# EAGLE design PCB-BI8-2x2 (EAGLE 6.4)

## Sheet 1 of 2
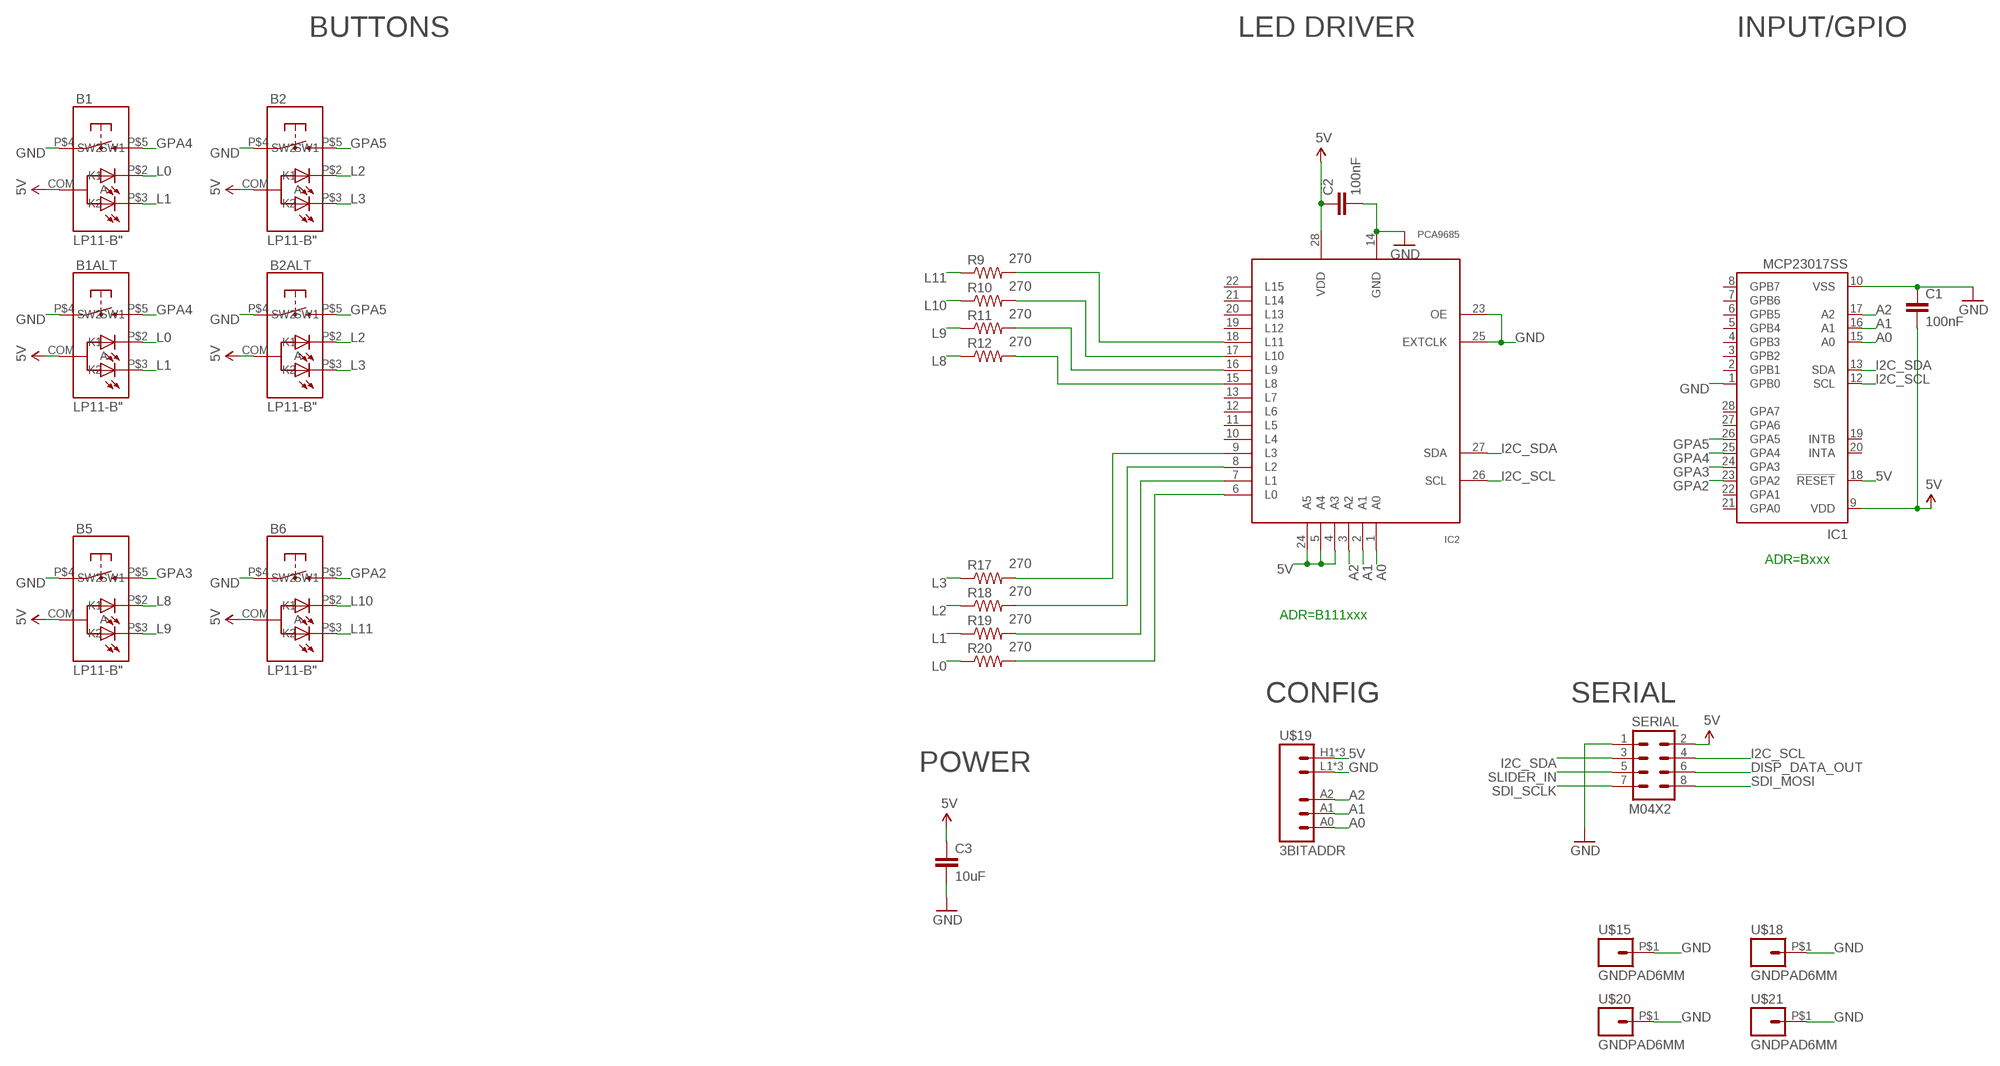
[diagram p0: schematic, sheet 1]

### Parts
B1  LP11-B"  [LP11]
B1ALT  LP11-B"  [LP11]
B2  LP11-B"  [LP11]
B2ALT  LP11-B"  [LP11]
B5  LP11-B"  [LP11]
B6  LP11-B"  [LP11]
C1  100nF  CAP0603-CAP  [0603-CAP]
C2  100nF  CAP0603-CAP  [0603-CAP]
C3  10uF  CAP0805  [0805]
IC1  MCP23017SS  [SSOP28]
IC2  PCA9685  [TSSOP28]
R9  270  RESISTOR0603-RES  [0603-RES]
R10  270  RESISTOR0603-RES  [0603-RES]
R11  270  RESISTOR0603-RES  [0603-RES]
R12  270  RESISTOR0603-RES  [0603-RES]
R17  270  RESISTOR0603-RES  [0603-RES]
R18  270  RESISTOR0603-RES  [0603-RES]
R19  270  RESISTOR0603-RES  [0603-RES]
R20  270  RESISTOR0603-RES  [0603-RES]
SERIAL  M04X2  [2X4]
U$15  GNDPAD6MM  [3.2MMPAD6MM]
U$18  GNDPAD6MM  [3.2MMPAD6MM]
U$19  3BITADDR  [3BITADDR]
U$20  GNDPAD6MM  [3.2MMPAD6MM]
U$21  GNDPAD6MM  [3.2MMPAD6MM]

### Nets
5V [Power]: B1.COM(A) B1ALT.COM(A) B2.COM(A) B2ALT.COM(A) B5.COM(A) B6.COM(A) C1.2 C2.1 C3.1 IC1.9(VDD) IC1.18(!RESET) IC2.4(A3) IC2.5(A4) IC2.24(A5) IC2.28(VDD) SERIAL.2 U$19.H1(VCC) U$19.H2(VCC) U$19.H3(VCC)
A0: IC1.15(A0) IC2.1(A0) U$19.A0
A1: IC1.16(A1) IC2.2(A1) U$19.A1
A2: IC1.17(A2) IC2.3(A2) U$19.A2
DISP_DATA_OUT: SERIAL.6
GND [Power]: B1.P$4(SW1) B1ALT.P$4(SW1) B2.P$4(SW1) B2ALT.P$4(SW1) B5.P$4(SW1) B6.P$4(SW1) C1.1 C2.2 C3.2 IC1.1(GPB0) IC1.10(VSS) IC2.14(GND) IC2.23(OE) IC2.25(EXTCLK) SERIAL.1 U$15.P$1 U$18.P$1 U$19.L1(GND) U$19.L2(GND) U$19.L3(GND) U$20.P$1 U$21.P$1
GPA2: B6.P$5(SW2) IC1.23(GPA2)
GPA3: B5.P$5(SW2) IC1.24(GPA3)
GPA4: B1.P$5(SW2) B1ALT.P$5(SW2) IC1.25(GPA4)
GPA5: B2.P$5(SW2) B2ALT.P$5(SW2) IC1.26(GPA5)
I2C_SCL: IC1.12(SCL) IC2.26(SCL) SERIAL.4
I2C_SDA: IC1.13(SDA) IC2.27(SDA) SERIAL.3
L0: B1.P$2(K1) B1ALT.P$2(K1) R20.1
L1: B1.P$3(K2) B1ALT.P$3(K2) R19.1
L2: B2.P$2(K1) B2ALT.P$2(K1) R18.1
L3: B2.P$3(K2) B2ALT.P$3(K2) R17.1
L8: B5.P$2(K1) R12.1
L9: B5.P$3(K2) R11.1
L10: B6.P$2(K1) R10.1
L11: B6.P$3(K2) R9.1
N$10: IC2.9(L3) R17.2
N$11: IC2.8(L2) R18.2
N$12: IC2.7(L1) R19.2
N$19: IC2.6(L0) R20.2
N$20: IC2.15(L8) R12.2
N$21: IC2.16(L9) R11.2
N$22: IC2.17(L10) R10.2
N$23: IC2.18(L11) R9.2
SDI_MOSI: SERIAL.8
SDI_SCLK: SERIAL.7
SLIDER_IN: SERIAL.5
Unconnected: IC1.2(GPB1) IC1.3(GPB2) IC1.4(GPB3) IC1.5(GPB4) IC1.6(GPB5) IC1.7(GPB6) IC1.8(GPB7) IC1.19(INTB) IC1.20(INTA) IC1.21(GPA0) IC1.22(GPA1) IC1.27(GPA6) IC1.28(GPA7) IC2.10(L4) IC2.11(L5) IC2.12(L6) IC2.13(L7) IC2.19(L12) IC2.20(L13) IC2.21(L14) IC2.22(L15)

### Notes on the sheet
- BUTTONS | LED DRIVER | INPUT/GPIO
- ADR=Bxxx
- ADR=B111xxx
- CONFIG | SERIAL
- POWER

## Sheet 2 of 2

## Library data of the parts
B1 B1ALT B2 B2ALT B5 B6 = SKAARHOJ:LP11-B
C1-C3 = SparkFun:CAP: Capacitor Standard 0603 ceramic capacitor, and 0.1" leaded capacitor.
IC1 = microchip:MCP23017: http://ww1.microchip.com/downloads/en/DeviceDoc/21952a.pdf Source: http://ww1.microchip.com/downloads/en/DeviceDoc/21952a.pdf; MF: MICROCHIP; MPN: MCP23017-E/SS; OC_FARNELL: 1467674; OC_NEWARK: 31K2960
IC2 = wsmith:PCA9685
R9-R12 R17-R20 = SparkFun:RESISTOR: Resistor Basic schematic elements and footprints for 0603, 1206, and PTH resistors.
SERIAL = SparkFun:M04X2
U$15 U$18 U$20 U$21 = SKAARHOJ:GNDPAD
U$19 = SKAARHOJ:3BITADDR

## Net classes
0 default: width 0.203 mm, drill 0.406 mm, clearance 0.203 mm
1 Power: width 0.406 mm, drill 0.61 mm, clearance 0.203 mm

## Board
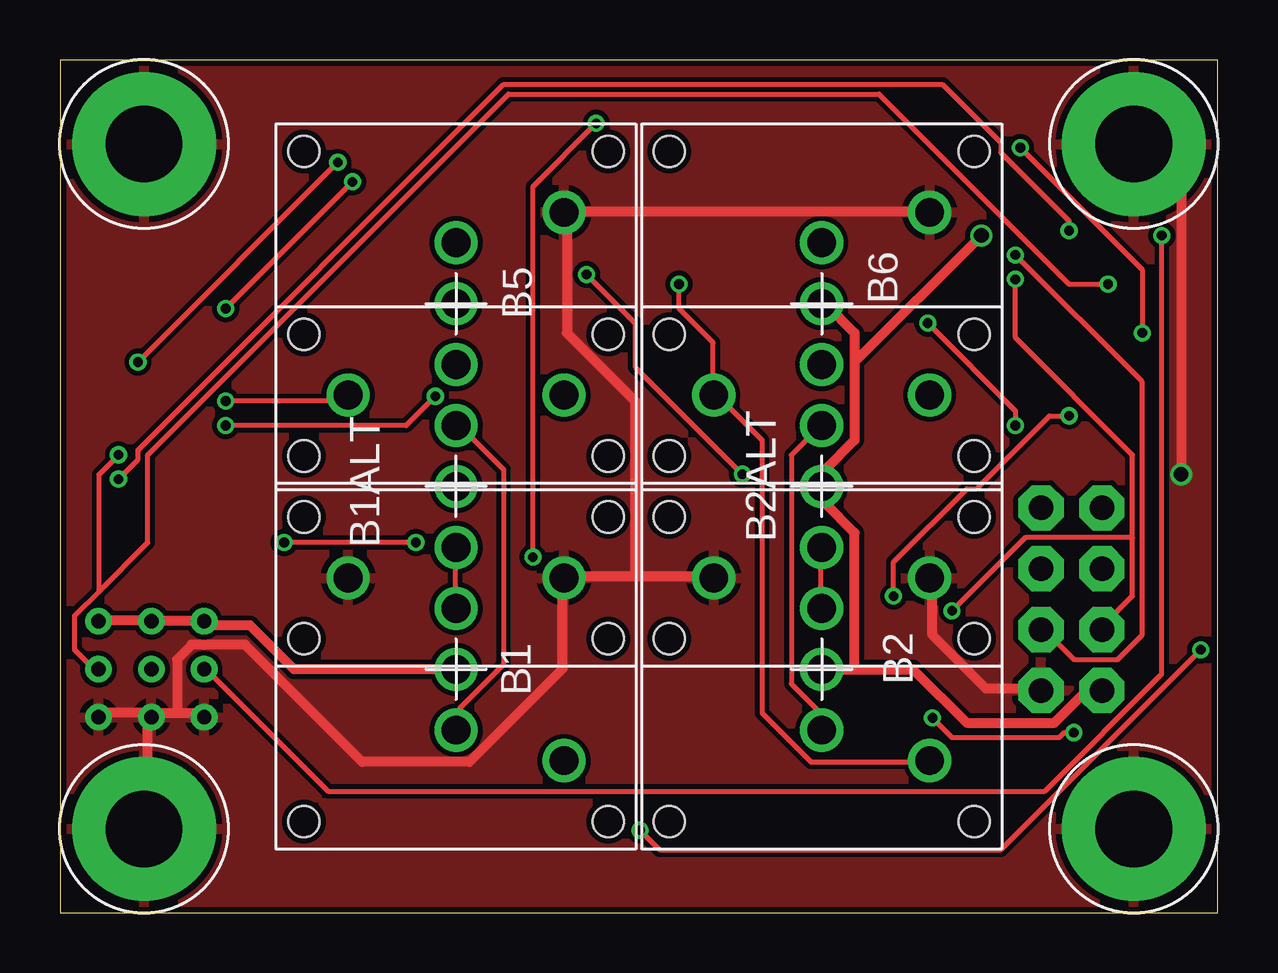
[diagram p1: board, top side]
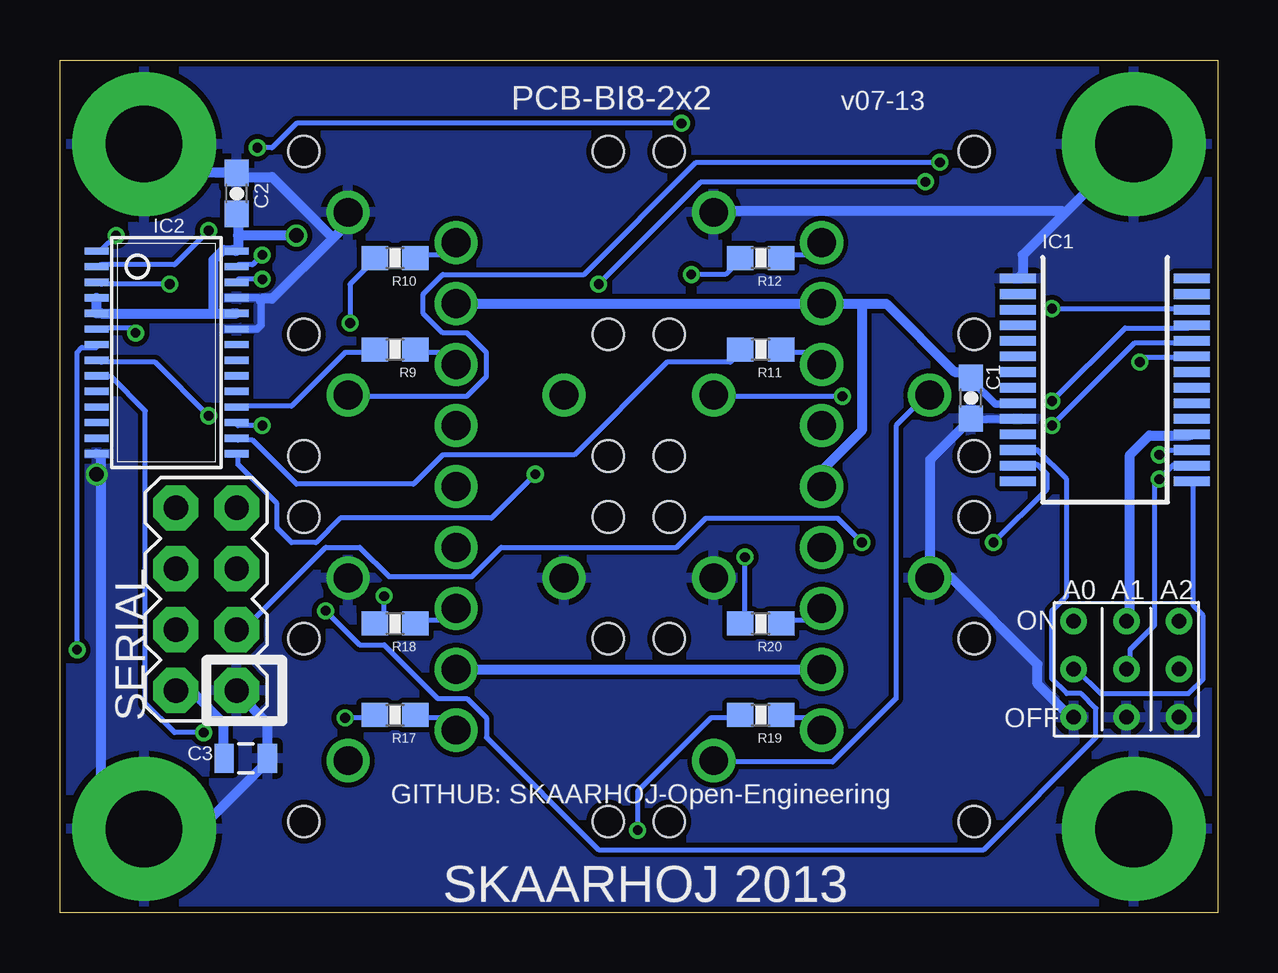
[diagram p2: board, bottom side, seen from below]

Size 48.26 x 35.56 mm. Coordinates in mm from the lower left corner, seen from the top.
Outline: 0,0 48.26,0 48.26,35.56 0,35.56 0,0
Copper layers (1*16): Top 0.035mm / dielectric 1.5mm / Bottom 0.035mm
Design rules "Fusion_eagle_rule_v1.1": minimum track width 6mil, minimum drill 12mil, track to track 6mil, track to pad 6mil, pad to pad 6mil, via to via 6mil, smd to smd 0mil, copper to edge 10mil, drill to drill 10mil, minimum pad ring 10mil, minimum via ring 6mil, stop-mask expansion 2mil, vias tented up to drill 100mil, thermal gap 10mil

### Footprints (pad centres in the part's own frame; a part is rotated, then mirrored left to right if it is on the bottom)
LP11 = drill 1.2: COM 0,0; P$2 0,2.54; P$3 0,-2.54; P$4 4.5,3.81; P$5 4.5,-3.81 | hole 1.3: -6.35,6.35; 6.35,6.35; 6.35,-6.35; -6.35,-6.35
0603-CAP = smd 1.1 x 1: 1 -0.85,0; 2 0.85,0
0805 = smd 0.8 x 1.2: 1 -0.9,0; 2 0.9,0
SSOP28 = smd 0.4 x 1.5: 1 -4.225,-3.625; 2 -3.575,-3.625; 3 -2.925,-3.625; 4 -2.275,-3.625; 5 -1.625,-3.625; 6 -0.975,-3.625; 7 -0.325,-3.625; 8 0.325,-3.625; 9 0.975,-3.625; 10 1.625,-3.625; 11 2.275,-3.625; 12 2.925,-3.625; 13 3.575,-3.625; 14 4.225,-3.625; 15 4.225,3.625; 16 3.575,3.625; 17 2.925,3.625; 18 2.275,3.625; 19 1.625,3.625; 20 0.975,3.625; 21 0.325,3.625; 22 -0.325,3.625; 23 -0.975,3.625; 24 -1.625,3.625; 25 -2.275,3.625; 26 -2.925,3.625; 27 -3.575,3.625; 28 -4.225,3.625
TSSOP28 = smd 0.305 x 0.991: 1 -4.225,-2.918; 2 -3.575,-2.918; 3 -2.925,-2.918; 4 -2.275,-2.918; 5 -1.625,-2.918; 6 -0.975,-2.918; 7 -0.325,-2.918; 8 0.325,-2.918; 9 0.975,-2.918; 10 1.625,-2.918; 11 2.275,-2.918; 12 2.925,-2.918; 13 3.575,-2.918; 14 4.225,-2.918; 15 4.225,2.918; 16 3.575,2.918; 17 2.925,2.918; 18 2.275,2.918; 19 1.625,2.918; 20 0.975,2.918; 21 0.325,2.918; 22 -0.325,2.918; 23 -0.975,2.918; 24 -1.625,2.918; 25 -2.275,2.918; 26 -2.925,2.918; 27 -3.575,2.918; 28 -4.225,2.918
0603-RES = smd 1.1 x 1: 1 -0.85,0; 2 0.85,0
2X4 = drill 1.016 pad 1.88 octagon: 1 -3.81,-1.27; 2 -3.81,1.27; 3 -1.27,-1.27; 4 -1.27,1.27; 5 1.27,-1.27; 6 1.27,1.27; 7 3.81,-1.27; 8 3.81,1.27
3.2MMPAD6MM = drill 3.2 pad 6: P$1 0,0
3BITADDR = drill 0.6: A0 -2.2,0; A1 0,0; A2 2.2,0; H1 -2.2,2; H2 0,2; H3 2.2,2; L1 -2.2,-2; L2 0,-2; L3 2.2,-2

### Placement (x,y rotation side)
B1  16.51,10.16 0 top
B1ALT  16.51,17.78 180 top
B2  31.75,10.16 0 top
B2ALT  31.75,17.78 180 top
B5  16.51,25.4 0 top
B6  31.75,25.4 0 top
C1  10.29,21.46 90 bottom
C2  40.89,30 90 bottom
C3  40.51,6.45 0 bottom
IC1  4.7,22.23 270 bottom
IC2  43.81,23.37 270 bottom
R9  34.29,23.5 180 bottom
R10  34.29,27.3 180 bottom
R11  19.05,23.5 180 bottom
R12  19.05,27.3 180 bottom
R17  34.29,8.26 180 bottom
R18  34.29,12.06 180 bottom
R19  19.05,8.26 180 bottom
R20  19.05,12.06 180 bottom
SERIAL  42.16,13.08 90 bottom
U$15  3.5,3.5 0 top
U$18  44.76,3.5 0 top
U$19  3.81,10.16 0 bottom
U$20  3.5,32.06 0 top
U$21  44.76,32.06 0 top

### Tracks (layer width: path | path; a pad name or v marks a point on that pad's centre or on a via)
5V  (via drill 0.61)
  Top 0.406: 33.12,22.96 33.12,24.18 31.9,25.4 B6.COM | 33.12,22.96 33.12,19.71 31.9,18.49 31.9,17.88 B2ALT.COM 31.9,17.68 31.9,17.07 33.12,15.85 33.12,10.16 | 33.12,22.96 v38.41,28.25 | U$19.H3 1.63,12.19 3.66,12.19 U$19.H2 3.86,12.19 5.89,12.19 U$19.H1 6.1,11.99 7.92,11.99 9.75,10.16 B1.COM | B2.COM 33.12,10.16 | 33.12,10.16 35.56,10.16 37.8,7.92 41.45,7.92 42.67,9.14 43.28,9.14 SERIAL.2
  Bottom 0.305: IC1.9 8.37,21.21 9.27,21.21 10.29,22.23 C1.2
  Bottom 0.406: 14.83,25.4 B5.COM B6.COM | 14.83,25.4 13.82,25.4 10.97,22.55 10.16,22.55 C1.2 | 14.83,25.4 14.83,20.12 16.46,18.49 16.46,17.88 B1ALT.COM | 40.84,28.25 40.84,29.06 C2.1 | 40.84,28.25 40.84,27.64 IC2.28 41.05,27.64 41.45,27.64 41.86,27.23 41.86,24.99 | 41.86,24.99 46.53,24.99 IC2.5 46.74,25.6 IC2.4 | 41.86,24.99 41.05,24.99 IC2.24 | v38.41,28.25 40.84,28.25 | IC1.18 1.22,19.91 2.85,19.91 3.66,19.1 3.66,12.19 U$19.H2 | C3.1 41.45,6.5 41.45,7.92 42.67,9.14 43.28,9.14 SERIAL.2 | B2.COM B1.COM
A0  (via drill 0.41)
  Top 0.203: v45.92,28.25 45.92,9.96 41.05,5.08 11.18,5.08 6.1,10.16 U$19.A0
  Bottom 0.203: v45.92,28.25 46.53,27.64 IC2.1 | IC1.15 1.02,17.88 1.02,12.8 0.61,12.39 0.61,9.75 1.22,9.14 4.88,9.14 5.89,10.16 U$19.A0
A1  (via drill 0.41)
  Top 0.203: v42.06,28.45 42.06,28.85 39.22,31.7 39.22,32.11 36.78,34.54 18.49,34.54 3.25,19.3 3.25,18.9 v2.44,18.09
  Bottom 0.203: v42.06,28.45 43.48,27.03 46.53,27.03 IC2.2 | IC1.16 1.22,18.69 1.83,18.69 v2.44,18.09 2.64,17.88 2.64,11.99 3.66,10.97 3.66,10.16 U$19.A1
A2  (via drill 0.41)
  Top 0.203: v43.69,26.21 42.06,26.21 34.14,34.14 18.69,34.14 3.66,19.1 3.66,15.44 1.63,13.41 | 1.63,13.41 0.61,12.39 0.61,10.97 1.42,10.16 U$19.A2 | v2.44,19.1 1.63,18.29 1.63,13.41
  Bottom 0.203: v43.69,26.21 46.53,26.21 IC2.3 | v2.44,19.1 2.23,19.3 1.22,19.3 IC1.17
GND  (via drill 0.61)
  Top 0.406: U$19.L3 1.63,8.33 3.66,8.33 U$19.L2 | 4.88,8.33 3.86,8.33 U$19.L2 | 4.88,8.33 5.89,8.33 U$19.L1 | U$19.L2 3.66,8.13 3.66,3.66 U$15.P$1 | B2.P$4 36.37,13.82 36.37,11.58 38.61,9.35 40.84,9.35 SERIAL.1 | 23.98,14.02 27.23,14.02 B2ALT.P$4 | 23.98,14.02 21.13,14.02 B1.P$4 20.93,13.82 20.93,10.16 17.07,6.3 12.6,6.3 7.72,11.18 5.49,11.18 4.88,10.57 4.88,8.33 | 23.98,14.02 23.98,21.34 21.13,24.18 21.13,29.06 B5.P$4 21.13,29.26 36.17,29.26 B6.P$4 | v46.74,18.29 46.74,30.07 44.91,31.9 U$21.P$1
  Bottom 0.305: IC2.25 40.89,25.65 40.01,25.65 39.88,25.53 39.88,24.51 40.05,24.34 IC2.23 | 10.16,20.73 10.01,20.57 9.65,20.57 9.63,20.6 IC1.10
  Bottom 0.406: C1.1 10.16,20.73 11.99,18.9 11.99,14.02 B1ALT.P$4 11.79,14.02 11.18,14.02 7.52,10.36 7.52,9.55 6.1,8.13 U$19.L1 | SERIAL.1 40.84,9.14 39.62,7.92 39.62,6.5 C3.2 39.62,6.3 42.27,3.66 44.7,3.66 U$18.P$1 44.91,3.66 46.53,5.28 46.53,18.29 | 46.53,18.29 46.53,19.1 IC2.14 | 36.88,28.14 36.37,28.65 36.37,29.06 B6.P$4 | 36.88,28.14 39.42,25.6 39.83,25.6 39.88,25.53 | U$21.P$1 44.7,31.9 43.69,30.89 41.05,30.89 C2.2 40.84,30.68 39.42,30.68 36.88,28.14 | U$20.P$1 6.4,29.16 | 6.4,29.16 8.13,27.43 8.13,26.62 IC1.1 | B5.P$4 20.93,29.26 6.5,29.26 6.4,29.16 | v46.74,18.29 46.53,18.29
  pour Top: 0,0 48.26,0 48.26,35.56 0,35.56
  pour Bottom: 0,0 48.26,0 48.26,35.56 0,35.56
GPA2  (via drill 0.41)
  Top 0.203: v11.58,31.29 v3.25,22.96
  Bottom 0.203: v3.25,22.96 3.05,23.16 1.22,23.16 IC1.23 | v11.58,31.29 21.74,31.29 26.42,26.62 32.31,26.62 33.12,25.81 33.12,24.99 32.31,24.18 31.29,24.18 30.48,23.37 30.48,22.35 31.29,21.54 36.17,21.54 B6.P$5
GPA3  (via drill 0.41)
  Top 0.203: v6.91,20.32 14.43,20.32 v15.65,21.54
  Bottom 0.203: v6.91,20.32 3.45,23.77 1.22,23.77 IC1.24 | v15.65,21.54 20.93,21.54 B5.P$5
GPA4  (via drill 0.41)
  Top 0.203: v6.91,21.34 11.79,21.34 11.99,21.54 B1ALT.P$5
  Bottom 0.203: v6.91,21.34 3.86,24.38 1.22,24.38 IC1.25 | B1.P$5 20.93,6.3 16.05,6.3 13.41,8.94 13.41,20.32 12.19,21.54 B1ALT.P$5
GPA5  (via drill 0.41)
  Top 0.203: v12.19,30.48 v6.91,25.2 | v25.81,26.21 25.81,25.2 27.23,23.77 27.23,21.74 B2ALT.P$5 27.43,21.54 29.26,19.71 29.26,8.33 31.29,6.3 36.17,6.3 B2.P$5
  Bottom 0.203: v6.91,25.2 1.22,25.2 IC1.26 | v12.19,30.48 21.54,30.48 v25.81,26.21
I2C_SCL  (via drill 0.41)
  Top 0.203: v39.83,26.42 39.83,23.98 44.7,19.1 44.7,15.65 | 44.7,15.65 44.7,13.21 43.48,11.99 SERIAL.4 | v37.19,12.6 40.23,15.65 44.7,15.65
  Bottom 0.203: v39.83,26.42 40.84,26.42 IC2.26 | v37.19,12.6 35.76,11.18 34.75,11.18 32.51,8.94 31.29,8.94 30.48,8.13 30.48,7.32 25.81,2.64 9.75,2.64 5.08,7.32 5.08,8.53 5.69,9.14 6.3,9.14 6.91,9.75 6.91,12.6 6.3,13.21 6.3,18.09 7.52,19.3 8.13,19.3 IC1.12
I2C_SDA  (via drill 0.41)
  Top 0.203: v39.83,27.43 45.11,22.15 45.11,11.58 44.09,10.57 42.27,10.57 41.05,11.79 SERIAL.3 | v14.83,15.44 v9.35,15.44
  Bottom 0.203: v39.83,27.43 40.23,27.03 40.84,27.03 IC2.27 | v9.35,15.44 7.11,17.68 7.11,18.29 7.52,18.69 8.13,18.69 IC1.13 | v14.83,15.44 15.85,16.46 21.34,16.46 22.55,15.24 29.87,15.24 31.09,14.02 34.54,14.02 35.76,15.24 37.19,15.24 40.44,11.99 40.84,11.99 SERIAL.3
L0
  Top 0.203: B1.P$2 16.46,12.8 16.46,15.24 B1ALT.P$2
  Bottom 0.203: R20.1 18.09,12.19 17.07,12.19 16.66,12.6 B1.P$2
L1
  Top 0.203: B1.P$3 16.66,7.72 16.66,8.53 18.49,10.36 18.49,18.49 16.66,20.32 B1ALT.P$3
  Bottom 0.203: R19.1 18.09,8.13 17.07,8.13 16.66,7.72 B1.P$3
L2
  Top 0.203: B2.P$2 31.7,12.8 31.7,15.24 B2ALT.P$2
  Bottom 0.203: R18.1 33.33,12.19 32.31,12.19 31.9,12.6 B2.P$2
L3
  Top 0.203: B2.P$3 31.7,7.72 31.7,8.33 30.48,9.55 30.48,19.1 31.7,20.32 B2ALT.P$3
  Bottom 0.203: R17.1 33.33,8.13 32.31,8.13 31.9,7.72 B2.P$3
L8
  Bottom 0.203: R12.1 18.09,27.43 17.07,27.43 16.66,27.84 B5.P$2
L9
  Bottom 0.203: R11.1 18.09,23.37 17.07,23.37 16.66,22.96 B5.P$3
L10
  Bottom 0.203: R10.1 33.33,27.43 32.31,27.43 31.9,27.84 B6.P$2
L11
  Bottom 0.203: R9.1 33.33,23.37 32.31,23.37 31.9,22.96 B6.P$3
N$10  (via drill 0.41)
  Top 0.203: v42.27,7.52 41.86,7.52 41.66,7.32 37.19,7.32 v36.37,8.13
  Bottom 0.203: v42.27,7.52 43.48,7.52 44.7,8.74 44.7,20.93 46.13,22.35 46.53,22.35 IC2.9 | v36.37,8.13 35.15,8.13 R17.2
N$11  (via drill 0.41)
  Top 0.203: v42.06,20.73 41.25,20.73 38.2,17.68 37.8,17.68 34.75,14.63 v34.75,13.21
  Bottom 0.203: v42.06,20.73 44.3,22.96 46.53,22.96 IC2.8 | v34.75,13.21 34.75,12.39 34.95,12.19 R18.2
N$12  (via drill 0.41)
  Top 0.203: v47.55,10.97 39.22,2.64 24.99,2.64 v24.18,3.45
  Bottom 0.203: v47.55,10.97 47.55,23.37 47.35,23.57 46.74,23.57 IC2.7 | v24.18,3.45 24.18,5.08 21.13,8.13 19.91,8.13 R19.2
N$19  (via drill 0.41)
  Top 0.203: v45.11,24.18 45.11,26.82 v40.03,31.9 | v22.35,32.92 19.71,30.28 v19.71,14.83
  Bottom 0.203: v45.11,24.18 45.31,24.38 46.53,24.38 IC2.6 | v40.03,31.9 39.42,31.9 38.41,32.92 v22.35,32.92 | v19.71,14.83 19.71,12.19 R20.2
N$20  (via drill 0.41)
  Top 0.203: v28.45,18.29 23.98,22.76 23.98,24.59 v21.95,26.62
  Bottom 0.203: v28.45,18.29 30.28,16.46 36.58,16.46 37.59,15.44 38.61,15.44 39.22,16.05 39.22,17.07 40.84,18.69 40.84,19.1 IC2.15 | v21.95,26.62 20.52,26.62 19.91,27.23 R12.2
N$21
  Bottom 0.203: IC2.16 40.84,19.71 40.23,19.71 38.41,17.88 33.53,17.88 32.31,19.1 26.82,19.1 22.96,22.96 20.32,22.96 19.91,23.37 R11.2
N$22  (via drill 0.41)
  Top 0.203: v39.83,20.32 39.83,20.93 v36.17,24.59
  Bottom 0.203: v39.83,20.32 40.84,20.32 IC2.17 | v36.17,24.59 36.17,26.21 35.15,27.23 R10.2
N$23
  Bottom 0.203: IC2.18 40.84,21.13 38.61,21.13 36.37,23.37 35.15,23.37 R9.2

### Text on the board
_bsilk: v07-13 | PCB-BI8-2x2 | GITHUB: SKAARHOJ-Open-Engineering | SKAARHOJ 2013